# EasyEDA schematic SCH_4S-modular-BMS-PCB-MK.2.json

## Sheets
1 Balancing and power: TITLE: Sheet_1; REV: 1.0; Date: 2025-12-22; Sheet: 1/1; Drawn By: hjalte; Company: Your Company
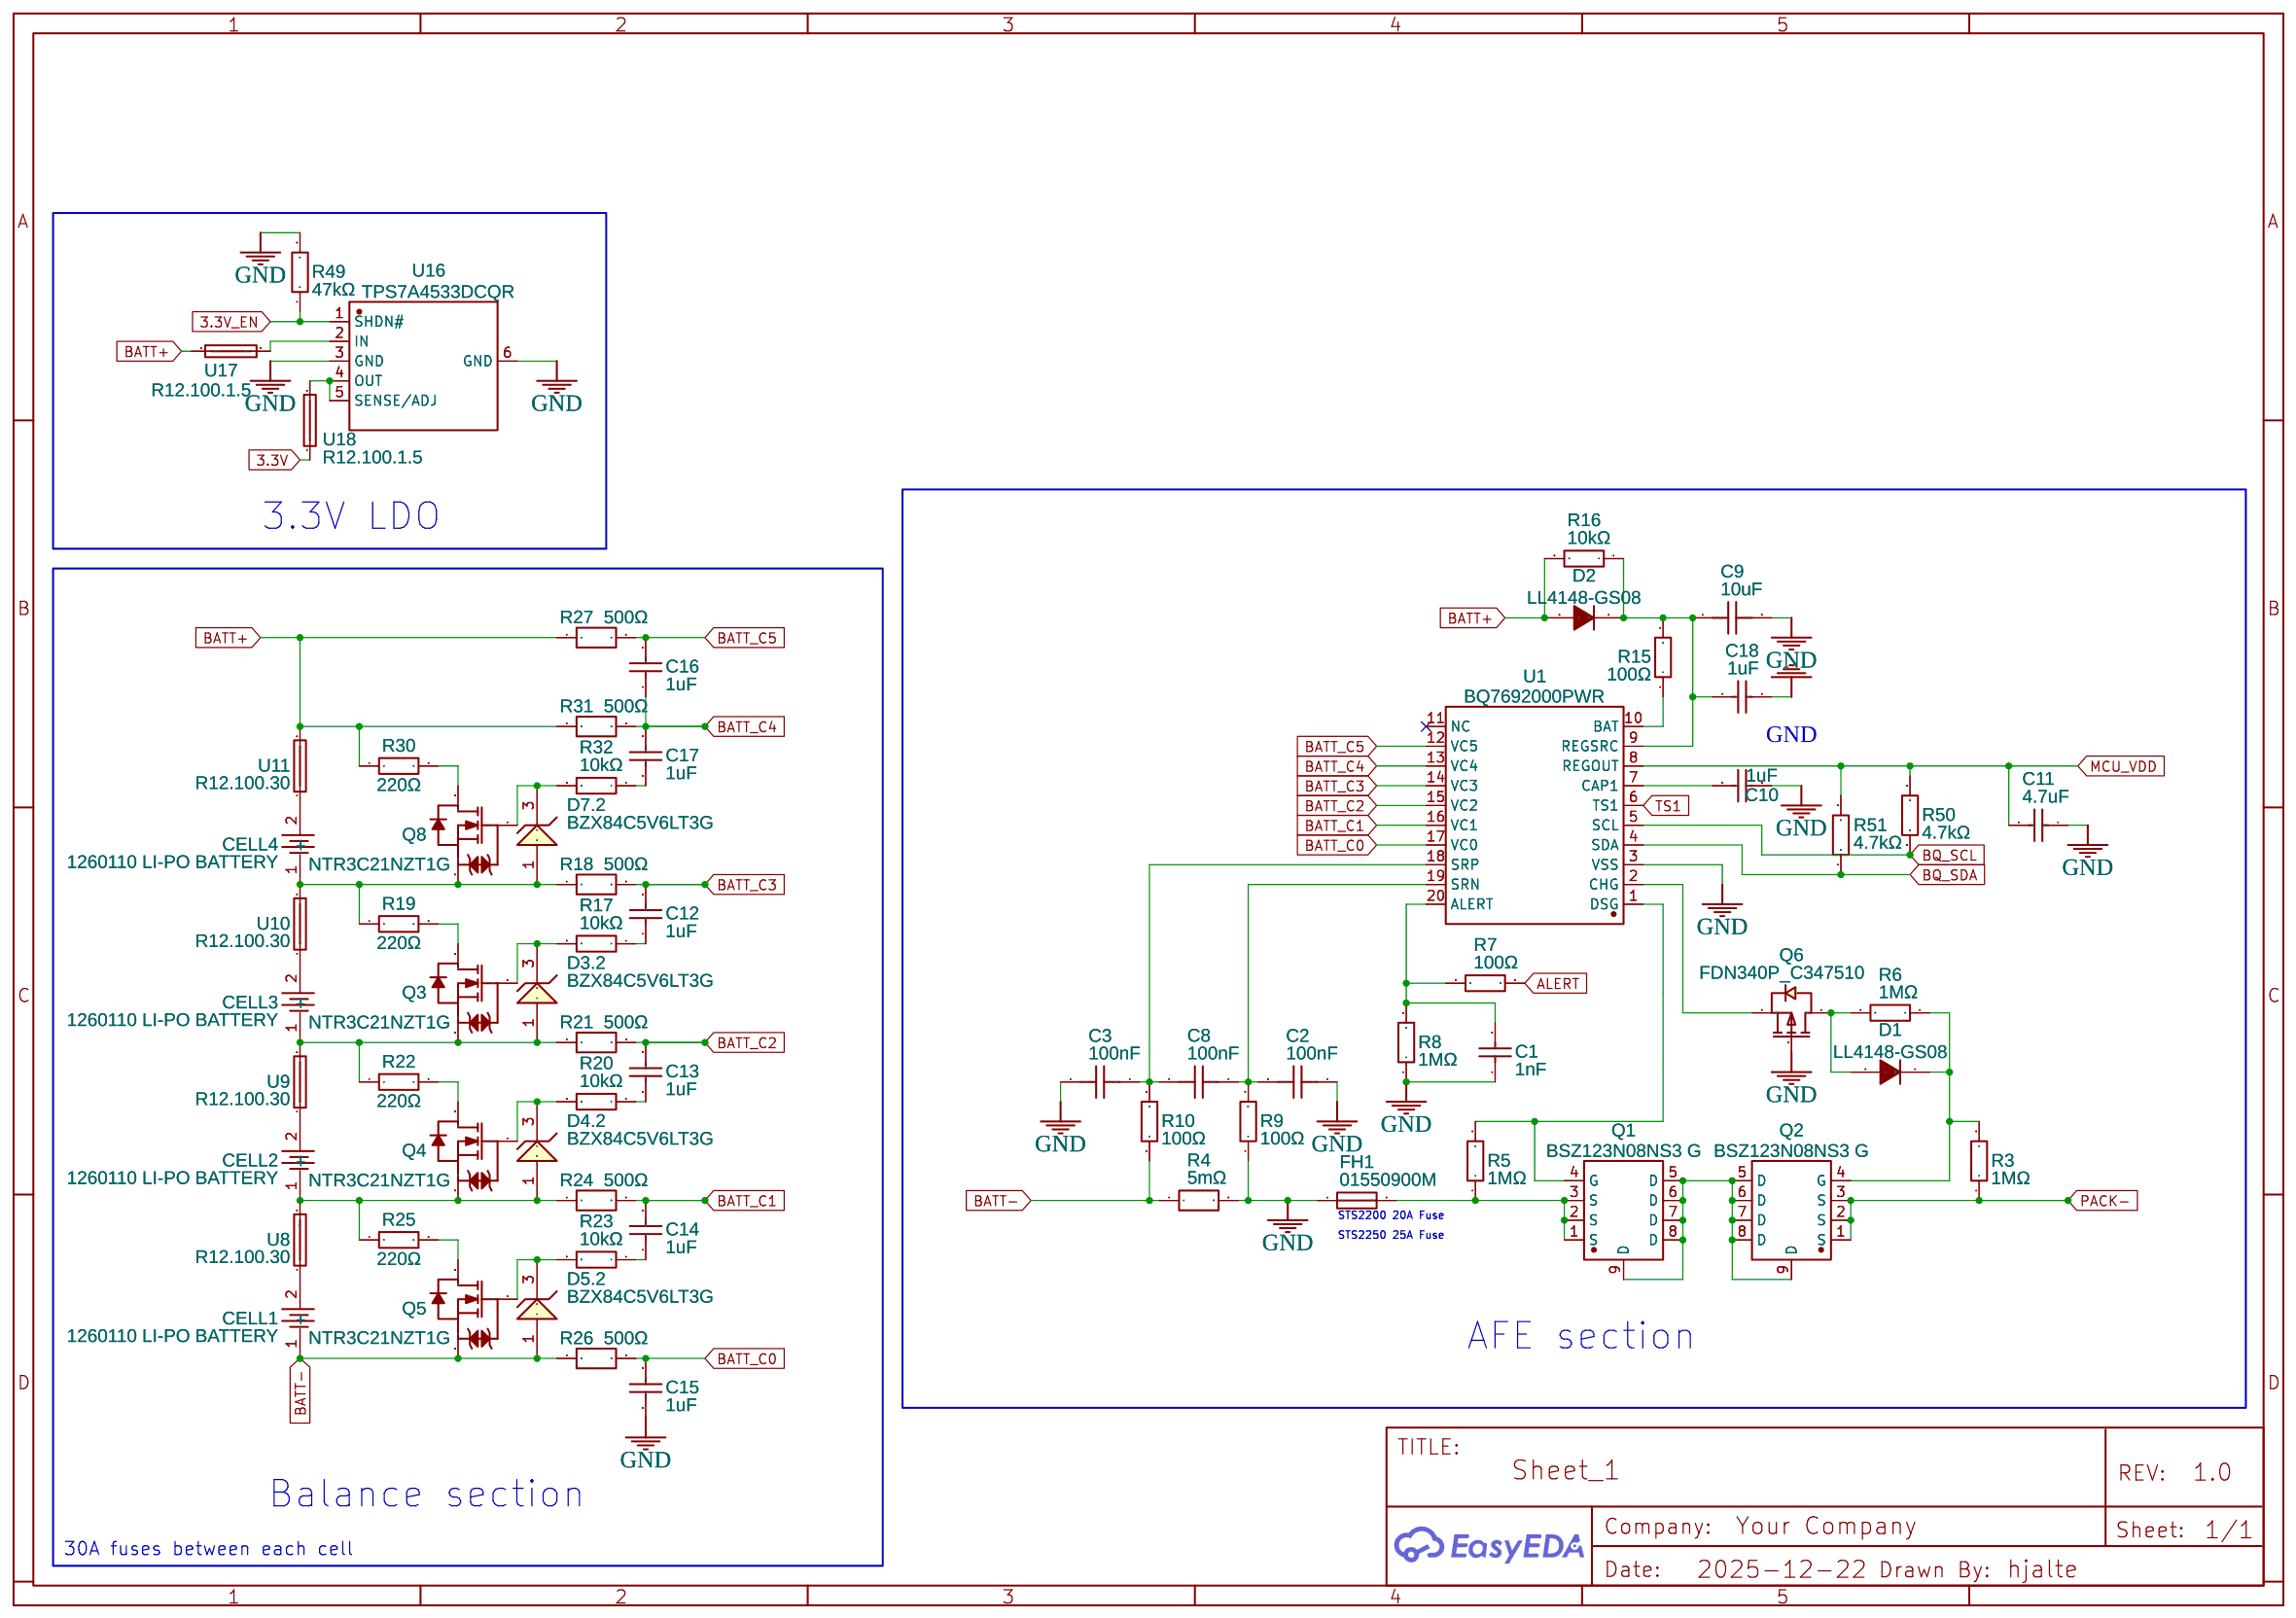
[diagram p0: Balancing and power]
2 Communication and power interface: Date: 2025-12-25
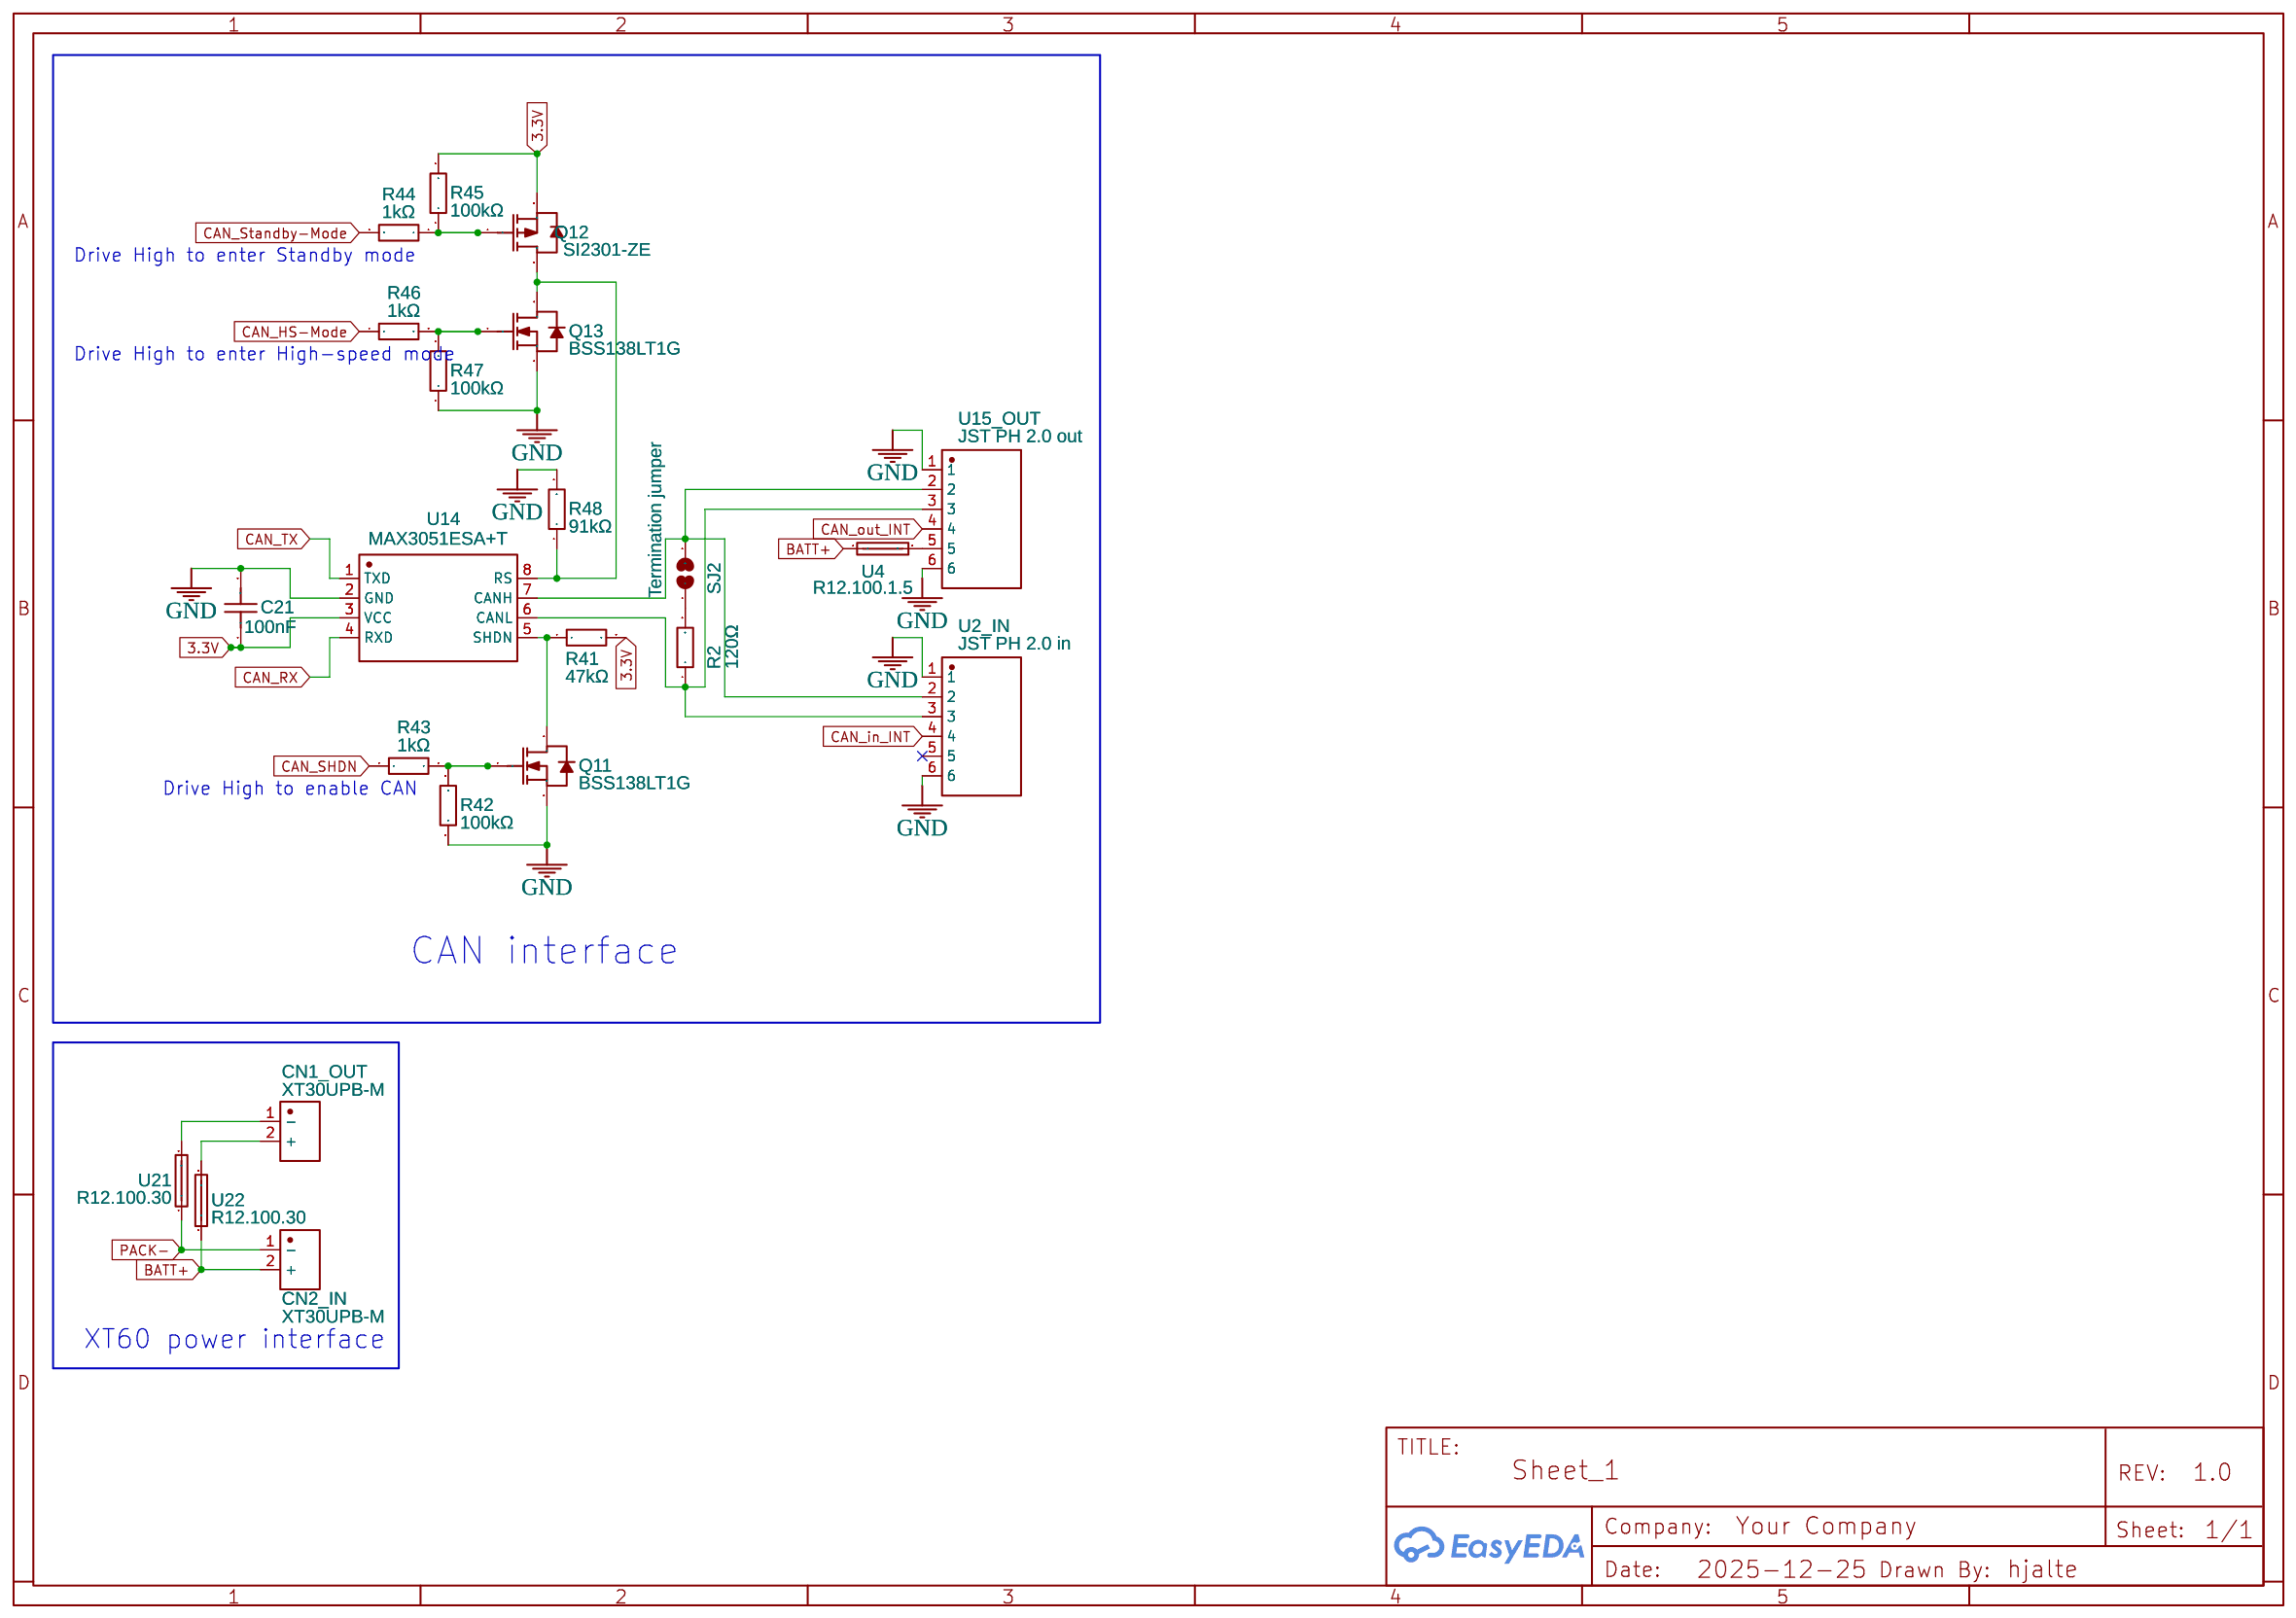
[diagram p1: Communication and power interface]
3 STM32 MCU: Date: 2025-12-25
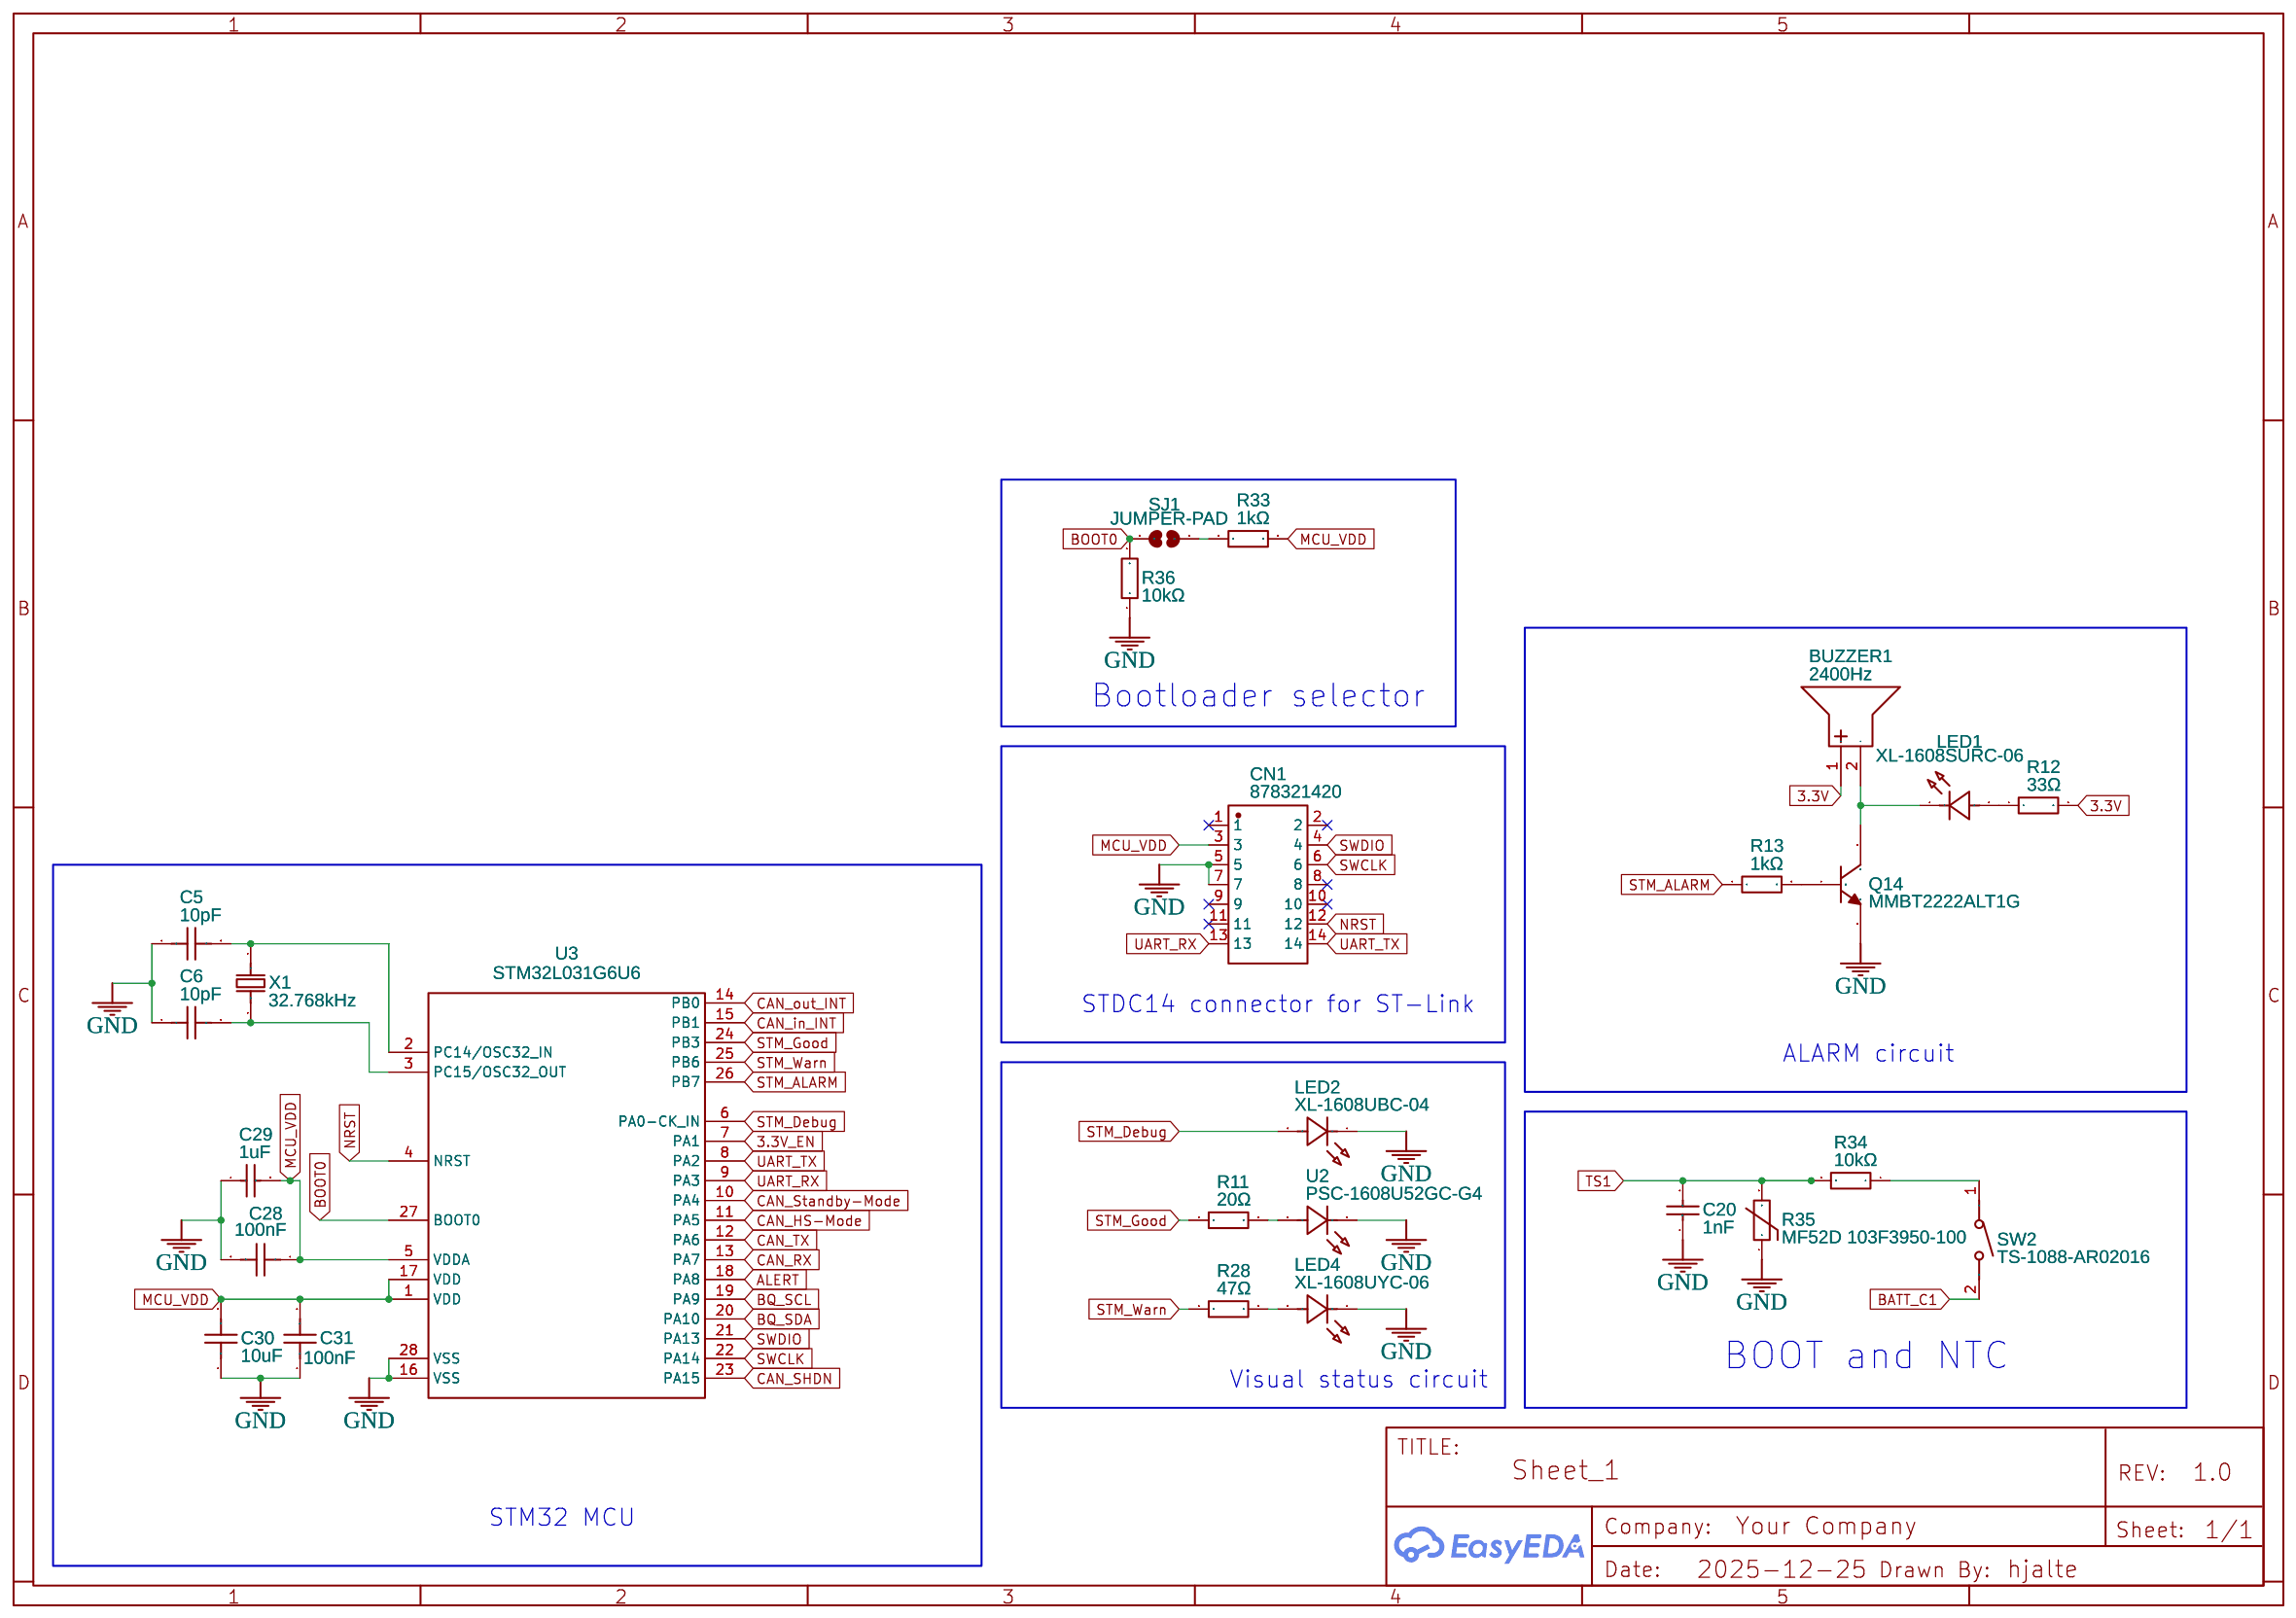
[diagram p2: STM32 MCU]

## Parts
sheet Balancing and power
C1  1nF  [C0603]
C2  100nF  [C0402]
C3  100nF  [C0402]
C8  100nF  [C0402]
C9  10uF  [C0603]
C10  1uF  [C0603]
C11  4.7uF  [C0603]
C12  1uF  [C0603]
C13  1uF  [C0603]
C14  1uF  [C0603]
C15  1uF  [C0603]
C16  1uF  [C0603]
C17  1uF  [C0603]
C18  1uF  [C0603]
CELL1  1260110 LI-PO BATTERY  [1260110 FOOTPRINT]
CELL2  1260110 LI-PO BATTERY  [1260110 FOOTPRINT]
CELL3  1260110 LI-PO BATTERY  [1260110 FOOTPRINT]
CELL4  1260110 LI-PO BATTERY  [1260110 FOOTPRINT]
D1  LL4148-GS08  [SOD-80_L3.5-W1.5-RD]
D2  LL4148-GS08  [SOD-80_L3.5-W1.5-RD]
D3  BZX84C5V6LT3G  [SOT23-3]  (section 2)
D4  BZX84C5V6LT3G  [SOT23-3]  (section 2)
D5  BZX84C5V6LT3G  [SOT23-3]  (section 2)
D7  BZX84C5V6LT3G  [SOT23-3]  (section 2)
FH1  01550900M  [FUSE-SMD_L9.8-W5.0_01550900M]
Q1  BSZ123N08NS3 G  [PG-TSDSON-8_L3.3-W3.3-P0.65-BL]
Q2  BSZ123N08NS3 G  [PG-TSDSON-8_L3.3-W3.3-P0.65-BL]
Q3  NTR3C21NZT1G  [SOT-23-3_L2.9-W1.6-P1.90-LS2.8-BR]
Q4  NTR3C21NZT1G  [SOT-23-3_L2.9-W1.6-P1.90-LS2.8-BR]
Q5  NTR3C21NZT1G  [SOT-23-3_L2.9-W1.6-P1.90-LS2.8-BR]
Q6  FDN340P_C347510  [SOT-23-3_L2.9-W1.3-P1.90-LS2.4-BR]
Q8  NTR3C21NZT1G  [SOT-23-3_L2.9-W1.6-P1.90-LS2.8-BR]
R3  1MΩ  [R0603]
R4  5mΩ  [R5930]
R5  1MΩ  [R0603]
R6  1MΩ  [R0603]
R7  100Ω  [R0603]
R8  1MΩ  [R0603]
R9  100Ω  [R0603]
R10  100Ω  [R0603]
R15  100Ω  [R0805]
R16  10kΩ  [R0603]
R17  10kΩ  [R0603]
R18  500Ω  [R0805]
R19  220Ω  [R0805]
R20  10kΩ  [R0603]
R21  500Ω  [R0805]
R22  220Ω  [R0805]
R23  10kΩ  [R0603]
R24  500Ω  [R0805]
R25  220Ω  [R0805]
R26  500Ω  [R0805]
R27  500Ω  [R0805]
R30  220Ω  [R0805]
R31  500Ω  [R0805]
R32  10kΩ  [R0603]
R49  47kΩ  [R0603]
R50  4.7kΩ  [R0603]
R51  4.7kΩ  [R0603]
U1  BQ7692000PWR  [TSSOP-20_L6.5-W4.4-P0.65-LS6.4-BL]
U8  R12.100.30  [FUSE-SMD_L3.2-W1.6]
U9  R12.100.30  [FUSE-SMD_L3.2-W1.6]
U10  R12.100.30  [FUSE-SMD_L3.2-W1.6]
U11  R12.100.30  [FUSE-SMD_L3.2-W1.6]
U16  TPS7A4533DCQR  [SOT-223-6_L6.5-W3.5-P1.27-BL]
U17  R12.100.1.5  [F1206]
U18  R12.100.1.5  [F1206]
sheet Communication and power interface
C21  100nF  [C0402]
CN1_OUT  XT30UPB-M  [CONN-TH_XT30UPB-M]
CN2_IN  XT30UPB-M  [CONN-TH_XT30UPB-M]
Q11  BSS138LT1G  [SOT-23-3_L2.9-W1.6-P1.90-LS2.8-BR]
Q12  SI2301-ZE  [SOT-23-3_L2.9-W1.3-P1.90-LS2.4-BR]
Q13  BSS138LT1G  [SOT-23-3_L2.9-W1.6-P1.90-LS2.8-BR]
R2  120Ω  [R0805]
R41  47kΩ  [R0603]
R42  100kΩ  [R0603]
R43  1kΩ  [R0603]
R44  1kΩ  [R0603]
R45  100kΩ  [R0603]
R46  1kΩ  [R0603]
R47  100kΩ  [R0603]
R48  91kΩ  [R0603]
SJ2  Termination jumper  [PAD-JUMPER-2-NO_YES_SILK]
U2_IN  JST PH 2.0 in  [CONN-TH_6P-P2.00_S6B-PH-K-S-LF-SN]
U4  R12.100.1.5  [F1206]
U14  MAX3051ESA+T  [SOIC-8_L4.9-W3.9-P1.27-LS6.0-BL]
U15_OUT  JST PH 2.0 out  [CONN-TH_6P-P2.00_S6B-PH-K-S-LF-SN]
U21  R12.100.30  [FUSE-SMD_L3.2-W1.6]
U22  R12.100.30  [FUSE-SMD_L3.2-W1.6]
sheet STM32 MCU
BUZZER1  2400Hz  [BUZ-SMD_FUET-1365-XXV]
C5  10pF  [C0402]
C6  10pF  [C0402]
C20  1nF  [C0603]
C28  100nF  [C0402]
C29  1uF  [C0603]
C30  10uF  [C0402]
C31  100nF  [C0402]
CN1  878321420  [CONN-SMD_878321420]
LED1  XL-1608SURC-06  [LED0603-RD_RED]
LED2  XL-1608UBC-04  [LED0603-RD_BLUE]
LED4  XL-1608UYC-06  [LED0603-RD-YELLOW]
Q14  MMBT2222ALT1G  [SOT-23-3_L2.9-W1.3-P1.90-LS2.4-BR]
R11  20Ω  [R0603]
R12  33Ω  [R0603]
R13  1kΩ  [R0603]
R28  47Ω  [R0603]
R33  1kΩ  [R0603]
R34  10kΩ  [R0603]
R35  MF52D 103F3950-100  [RES-TH_BD3.0-P2.00-D0.3]
R36  10kΩ  [R0603]
SJ1  JUMPER-PAD  [PAD-JUMPER-2-NO_YES_SILK]
SW2  TS-1088-AR02016  [SW-SMD_L3.9-W3.0-P4.45]
U2  PSC-1608U52GC-G4  [LED0603-RD_GREEN]
U3  STM32L031G6U6  [UFQFPN-28_L4.0-W4.0-P0.50-BL]
X1  32.768kHz  [FC-135R_L3.2-W1.5]

## Library data of the parts
C1 C20 = CC0603KRX7R9BB102: Supplier: LCSC; Manufacturer: YAGEO(国巨); Supplier Part: C100040; JLCPCB Part Class: Extended Part
C2 C3 C8 C21 C28 C31 = CL05B104KP5NNNC: Contributor: LCSC; Supplier: LCSC; Supplier Part: C133086; Manufacturer: SAMSUNG(三星); JLCPCB Part Class: Extended Part; Package Display: No
C9 = CL10A106KP8NNNC: Supplier: LCSC; Manufacturer: SAMSUNG(三星); Supplier Part: C19702; JLCPCB Part Class: Basic Part
C10 C12-C18 C29 = CL10A105KO8NNNC: Supplier: LCSC; Manufacturer: SAMSUNG(三星); Supplier Part: C1592; JLCPCB Part Class: Extended Part
C11 = CL10A475KP8NNNC: Supplier: LCSC; Manufacturer: SAMSUNG(三星); Supplier Part: C1705; JLCPCB Part Class: Extended Part
CELL1-CELL4 = 1260110 LI-PO BATTERY: Contributor: lcsc
D1 D2 = LL4148-GS08: Supplier: LCSC; Manufacturer: VISHAY(威世); Supplier Part: C68883; JLCPCB Part Class: Extended Part
D3-D5 D7 = BZX84C5V6LT3G: Zener Voltage Regulator, 225 mW, 3-Pin SOT-23, Pb-Free, Tape and Reel; subpart_no: 2
FH1 = 01550900M: Contributor: LCSC; Supplier: LCSC; Supplier Part: C108518; Manufacturer: Littelfuse(美国力特); JLCPCB Part Class: Extended Part
Q1 Q2 = BSZ123N08NS3 G: Contributor: LCSC; Supplier: LCSC; Supplier Part: C152364; Manufacturer: Infineon(英飞凌); Manufacturer Part: BSZ123N08NS3G; JLCPCB Part Class: Extended Part
Q3-Q5 Q8 = NTR3C21NZT1G_C5123937: Contributor: lcsc; Supplier: LCSC; Supplier Part: C5123937; Manufacturer: TECH PUBLIC(台舟); JLCPCB Part Class: Extended Part
Q6 = FDN340P_C347510: Contributor: LCSC; Supplier: LCSC; Supplier Part: C347510; Manufacturer: UMW(友台半导体); Manufacturer Part: FDN340P(UMW); JLCPCB Part Class: Extended Part
R3 R5 R6 R8 = RC0603FR-071ML: Supplier: LCSC; Manufacturer: YAGEO(国巨); Supplier Part: C105578; JLCPCB Part Class: Extended Part
R4 = HOSRX5930-7W-5MR-1%: Supplier: LCSC; Supplier Part: C18724176; Manufacturer: Milliohm(毫欧); Manufacturer Part: HoSRX5930-7W-5mR-1%; JLCPCB Part Class: Extended Part; Contributor: lcsc
R7 R9 R10 = RC0603FR-07100RL: Supplier: LCSC; Manufacturer: YAGEO(国巨); Supplier Part: C105588; JLCPCB Part Class: Extended Part
R15 = RC0805FR-07100RL: Supplier: LCSC; Manufacturer: YAGEO(国巨); Supplier Part: C105577; JLCPCB Part Class: Extended Part
R16 R17 R20 R23 R32 R34 R36 = RC0603FR-0710KL: Supplier: LCSC; Manufacturer: YAGEO(国巨); Supplier Part: C98220; JLCPCB Part Class: Extended Part
R18 R21 R24 R26 R27 R31 = ARG05BTC5000: Supplier: LCSC; Supplier Part: C2828711; Manufacturer: Viking(光颉); Contributor: lcsc; JLCPCB Part Class: Extended Part
R19 R22 R25 R30 = 0805W8F2200T5E: Supplier: LCSC; Manufacturer: UNI-ROYAL(厚声); Supplier Part: C17557; JLCPCB Part Class: Basic Part
R41 R49 = RC0603FR-0747KL: Supplier: LCSC; Manufacturer: YAGEO(国巨); Supplier Part: C105579; JLCPCB Part Class: Extended Part
R50 R51 = RC0603FR-074K7L: Supplier: LCSC; Manufacturer: YAGEO(国巨); Supplier Part: C99782; JLCPCB Part Class: Extended Part
U1 = BQ7692000PWR: Contributor: LCSC; Supplier: LCSC; Supplier Part: C2871396; Manufacturer: TI(德州仪器); JLCPCB Part Class: Extended Part
U8-U11 U21 U22 = R12.100.30: Supplier: LCSC; Supplier Part: C5383211; Manufacturer: Reomax(瑞迈); Contributor: lcsc; JLCPCB Part Class: Extended Part
U16 = TPS7A4533DCQR: Contributor: LCSC; Supplier: LCSC; Supplier Part: C2877942; Manufacturer: TI(德州仪器); JLCPCB Part Class: Extended Part
U4 U17 U18 = R12.100.1.5: Supplier: LCSC; Supplier Part: C2874923; Manufacturer: Reomax(瑞迈); JLCPCB Part Class: Extended Part; Contributor: lcsc
CN1_OUT CN2_IN = XT30UPB-M: Contributor: LCSC; Supplier: LCSC; Supplier Part: C428721; Manufacturer: AMASS(艾迈斯); JLCPCB Part Class: Extended Part
Q11 Q13 = BSS138LT1G: Supplier: LCSC; Manufacturer: onsemi(安森美); Supplier Part: C82045; JLCPCB Part Class: Extended Part
Q12 = SI2301-ZE: Contributor: lcsc; Supplier: LCSC; Supplier Part: C5261052; Manufacturer: HXY MOSFET(华轩阳电子); JLCPCB Part Class: Extended Part
R2 = 0805W8F1200T5E: Supplier: LCSC; Manufacturer: UNI-ROYAL(厚声); Supplier Part: C17437; JLCPCB Part Class: Basic Part
R42 R45 R47 = RC0603FR-07100KL: Contributor: LCSC; Supplier: LCSC; Supplier Part: C14675; Manufacturer: YAGEO(国巨); JLCPCB Part Class: Extended Part
R13 R33 R43 R44 R46 = RC0603FR-071KL: Supplier: LCSC; Manufacturer: YAGEO(国巨); Supplier Part: C22548; JLCPCB Part Class: Extended Part
R48 = 0603WAF9102T5E: Supplier: LCSC; Manufacturer: UNI-ROYAL(厚声); Supplier Part: C23265; JLCPCB Part Class: Extended Part
SJ1 SJ2 = JUMPER-PAD: Contributor: hjalte
U2_IN U15_OUT = S6B-PH-K-S-(LF)(SN): Contributor: LCSC; Supplier: LCSC; Supplier Part: C157920; Manufacturer: JST; Manufacturer Part: S6B-PH-K-S(LF)(SN); JLCPCB Part Class: Extended Part
U14 = MAX3051ESA+T: Supplier: LCSC; Manufacturer: ADI(亚德诺)/MAXIM(美信); Supplier Part: C15648; JLCPCB Part Class: Extended Part
BUZZER1 = FUET-1365-5V: Contributor: LCSC; Supplier: LCSC; Supplier Part: C417423; Manufacturer: FUET(福声科技); JLCPCB Part Class: Extended Part
C5 C6 = CC0402FRNPO9BN100: Contributor: LCSC; Supplier: LCSC; Supplier Part: C513681; Manufacturer: YAGEO(国巨); JLCPCB Part Class: Extended Part
C30 = CL05A106MP5NUNC_C315248: Contributor: LCSC; Supplier: LCSC; Supplier Part: C315248; Manufacturer: SAMSUNG(三星); Manufacturer Part: CL05A106MP5NUNC; JLCPCB Part Class: Extended Part
CN1 = 878321420: Contributor: LCSC; Supplier: LCSC; Supplier Part: C492354; Manufacturer: MOLEX; JLCPCB Part Class: Extended Part
LED1 = XL-1608SURC-06: Contributor: LCSC; Supplier: LCSC; Supplier Part: C965799; Manufacturer: XINGLIGHT(成兴光); JLCPCB Part Class: Extended Part
LED2 = XL-1608UBC-04: Contributor: LCSC; Supplier: LCSC; Supplier Part: C965807; Manufacturer: XINGLIGHT(成兴光); JLCPCB Part Class: Extended Part
LED4 = XL-1608UYC-06: Contributor: lcsc; Supplier: LCSC; Supplier Part: C965802; Manufacturer: XINGLIGHT(成兴光); JLCPCB Part Class: Extended Part
Q14 = MMBT2222ALT1G: Supplier: LCSC; Manufacturer: onsemi(安森美); Supplier Part: C82460; JLCPCB Part Class: Extended Part
R11 = 0603WAF200JT5E: Supplier: LCSC; Manufacturer: UNI-ROYAL(厚声); Supplier Part: C22950; JLCPCB Part Class: Basic Part
R12 = RC0603FR-0733RL: Supplier: LCSC; Manufacturer: YAGEO(国巨); Supplier Part: C108661; JLCPCB Part Class: Extended Part
R28 = 0603WAF470JT5E: Supplier: LCSC; Manufacturer: UNI-ROYAL(厚声); Supplier Part: C23182; JLCPCB Part Class: Basic Part
R35 = MF52D 103F3950-100: Contributor: lcsc; Supplier: LCSC; Supplier Part: C394024; Manufacturer: 时恒; JLCPCB Part Class: Extended Part
SW2 = TS-1088-AR02016: Contributor: LCSC; Supplier: LCSC; Supplier Part: C720477; Manufacturer: XUNPU(讯普); JLCPCB Part Class: Basic Part
U2 = PSC-1608U52GC-G4: Supplier: LCSC; Supplier Part: C22371297; Manufacturer: HONGLITRONIC(鸿利光电); JLCPCB Part Class: Extended Part; Contributor: lcsc
U3 = STM32L031G6U6: Voltage - Supply: 1.8V ~ 3.6V; Contributor: LCSC; Supplier: LCSC; Manufacturer: ST(意法半导体); Supplier Part: C96514; JLCPCB Part Class: Extended Part
X1 = Q13FC1350000400: Supplier: LCSC; Manufacturer Part: Q13FC13500004; Manufacturer: EPSON(爱普生); Supplier Part: C32346; JLCPCB Part Class: Basic Part

## Nets
3.3V: BUZZER1.1(+) C21.1 Q12.2(S) R12.2 R41.2 R45.2 U14.3(VCC) U18.1
3.3V_EN: R49.1 U3.7(PA1) U16.1(SHDN#)
GND: C1.1 C2.1 C3.2 C5.1 C6.1 C9.2 C10.2 C11.1 C15.1 C18.2 C20.1 C21.2 C28.2 C29.1 C30.1 C31.1 CN1.5 CN1.7 FH1.1 LED2.1(K) LED4.1(K) Q6.1(G) Q11.2(S) Q13.2(S) Q14.2(E) R4.2 R8.1 R9.1 R35.1 R36.1 R42.1 R47.1 R48.2 R49.2 U1.3(VSS) U2.1(K) U2_IN.1 U2_IN.6 U3.16(VSS) U3.28(VSS) U14.2(GND) U15_OUT.1 U15_OUT.6 U16.3(GND) U16.6(GND)
ALERT: R7.2 U3.18(PA8)
BATT+: CN2_IN.2(+) D2.2(A) R16.2 R27.1 R30.1 R31.1 U4.1 U11.2 U17.1 U22.1
BATT-: CELL1.1(-) D5.1(A) Q5.2(S) R4.1 R10.1 R26.1
BATT_C0: C15.2 R26.2 U1.17(VC0)
BATT_C1: C14.2 R24.2 SW2.2 U1.16(VC1)
BATT_C2: C13.2 R21.2 U1.15(VC2)
BATT_C3: C12.2 R18.2 U1.14(VC3)
BATT_C4: C16.1 C17.2 R31.2 U1.13(VC4)
BATT_C5: C16.2 R27.2 U1.12(VC5)
BOOT0: R36.2 SJ1.1 U3.27(BOOT0)
BQ_SCL: R50.1 U1.5(SCL) U3.19(PA9)
BQ_SDA: R51.1 U1.4(SDA) U3.20(PA10)
CAN_HS-Mode: R46.1 U3.11(PA5)
CAN_in_INT: U2_IN.4 U3.15(PB1)
CAN_out_INT: U3.14(PB0) U15_OUT.4
CAN_RX: U3.13(PA7) U14.4(RXD)
CAN_SHDN: R43.1 U3.23(PA15)
CAN_Standby-Mode: R44.2 U3.10(PA4)
CAN_TX: U3.12(PA6) U14.1(TXD)
MCU_VDD: C11.2 C28.1 C29.2 C30.2 C31.2 CN1.3 R33.2 R50.2 R51.2 U1.8(REGOUT) U3.1(VDD) U3.5(VDDA) U3.17(VDD)
NRST: CN1.12 U3.4(NRST)
PACK-: CN2_IN.1(-) Q2.1(S) Q2.2(S) Q2.3(S) R3.1 U21.1
STM_ALARM: R13.1 U3.26(PB7)
STM_Debug: LED2.2(A) U3.6(PA0-CK_IN)
STM_Good: R11.1 U3.24(PB3)
STM_Warn: R28.1 U3.25(PB6)
SWCLK: CN1.6 U3.22(PA14)
SWDIO: CN1.4 U3.21(PA13)
TS1: C20.2 R34.2 R35.2 U1.6(TS1)
UART_RX: CN1.13 U3.9(PA3)
UART_TX: CN1.14 U3.8(PA2)
Net-(BUZZER1-2): BUZZER1.2(-) LED1.1(K) Q14.3(C)
Net-(C1-2): C1.2 R7.1 R8.2 U1.20(ALERT)
Net-(C2-2): C2.2 C8.1 R9.2 U1.19(SRN)
Net-(C3-1): C3.1 C8.2 R10.2 U1.18(SRP)
Net-(C5-2): C5.2 U3.2(PC14/OSC32_IN) X1.1
Net-(C6-2): C6.2 U3.3(PC15/OSC32_OUT) X1.2
Net-(C9-1): C9.1 C18.1 D2.1(C) R15.2 R16.1 U1.9(REGSRC)
Net-(C10-1): C10.1 U1.7(CAP1)
Net-(C12-1): C12.1 R17.1
Net-(C13-1): C13.1 R20.1
Net-(C14-1): C14.1 R23.1
Net-(C17-1): C17.1 R32.1
Net-(CELL1-2): CELL1.2(+) U8.1
Net-(CELL2-1): CELL2.1(-) D4.1(A) Q4.2(S) R24.1 R25.1 U8.2
Net-(CELL2-2): CELL2.2(+) U9.1
Net-(CELL3-1): CELL3.1(-) D3.1(A) Q3.2(S) R21.1 R22.1 U9.2
Net-(CELL3-2): CELL3.2(+) U10.1
Net-(CELL4-1): CELL4.1(-) D7.1(A) Q8.2(S) R18.1 R19.1 U10.2
Net-(CELL4-2): CELL4.2(+) U11.1
Net-(CN1_OUT-1): CN1_OUT.1(-) U21.2
Net-(CN1_OUT-2): CN1_OUT.2(+) U22.2
Net-(D1-1): D1.1(C) Q2.4(G) R3.2 R6.1
Net-(D1-2): D1.2(A) Q6.3(D) R6.2
Net-(D3.2-3): D3.3(K) Q3.1(G) R17.2
Net-(D4.2-3): D4.3(K) Q4.1(G) R20.2
Net-(D5.2-3): D5.3(K) Q5.1(G) R23.2
Net-(D7.2-3): D7.3(K) Q8.1(G) R32.2
Net-(FH1-2): FH1.2 Q1.1(S) Q1.2(S) Q1.3(S) R5.1
Net-(LED1-2): LED1.2(A) R12.1
Net-(LED4-2): LED4.2(A) R28.2
Net-(Q1-4): Q1.4(G) R5.2 U1.1(DSG)
Net-(Q1-5): Q1.5(D) Q1.6(D) Q1.7(D) Q1.8(D) Q1.9(D) Q2.5(D) Q2.6(D) Q2.7(D) Q2.8(D) Q2.9(D)
Net-(Q3-3): Q3.3(D) R19.2
Net-(Q4-3): Q4.3(D) R22.2
Net-(Q5-3): Q5.3(D) R25.2
Net-(Q6-2): Q6.2(S) U1.2(CHG)
Net-(Q8-3): Q8.3(D) R30.2
Net-(Q11-1): Q11.1(G) R42.2 R43.2
Net-(Q11-3): Q11.3(D) R41.1 U14.5(SHDN)
Net-(Q12-1): Q12.1(G) R44.1 R45.1
Net-(Q12-3): Q12.3(D) Q13.3(D) R48.1 U14.8(RS)
Net-(Q13-1): Q13.1(G) R46.2 R47.2
Net-(Q14-1): Q14.1(B) R13.2
Net-(R2-1): R2.1 U2_IN.3 U14.6(CANL) U15_OUT.3
Net-(R2-2): R2.2 SJ2.1
Net-(R11-2): R11.2 U2.2(A)
Net-(R15-1): R15.1 U1.10(BAT)
Net-(R33-1): R33.1 SJ1.2
Net-(R34-1): R34.1 SW2.1
Net-(SJ2-2): SJ2.2 U2_IN.2 U14.7(CANH) U15_OUT.2
Net-(U4-2): U4.2 U15_OUT.5
Net-(U16-2): U16.2(IN) U17.2
Net-(U16-4): U16.4(OUT) U16.5(SENSE/ADJ) U18.2

Not connected (* = marked no-connect by the designer): CN1 1* 2* 8* 9* 10* 11*; U1 11(NC)*; U2_IN 5*

## Notes on the sheets
sheet 1
- 3.3V LDO
- STS2200 20A Fuse
- STS2250 25A Fuse
- AFE section
- Balance section
- 30A fuses between each cell
sheet 2
- Drive High to enter Standby mode
- Drive High to enter High-speed mode
- Drive High to enable CAN
- CAN interface
- XT60 power interface
sheet 3
- Bootloader selector
- STDC14 connector for ST-Link
- ALARM circuit
- BOOT and NTC
- Visual status circuit
- STM32 MCU
